# EAGLE schematic ex.05 (EAGLE 9.6.2)
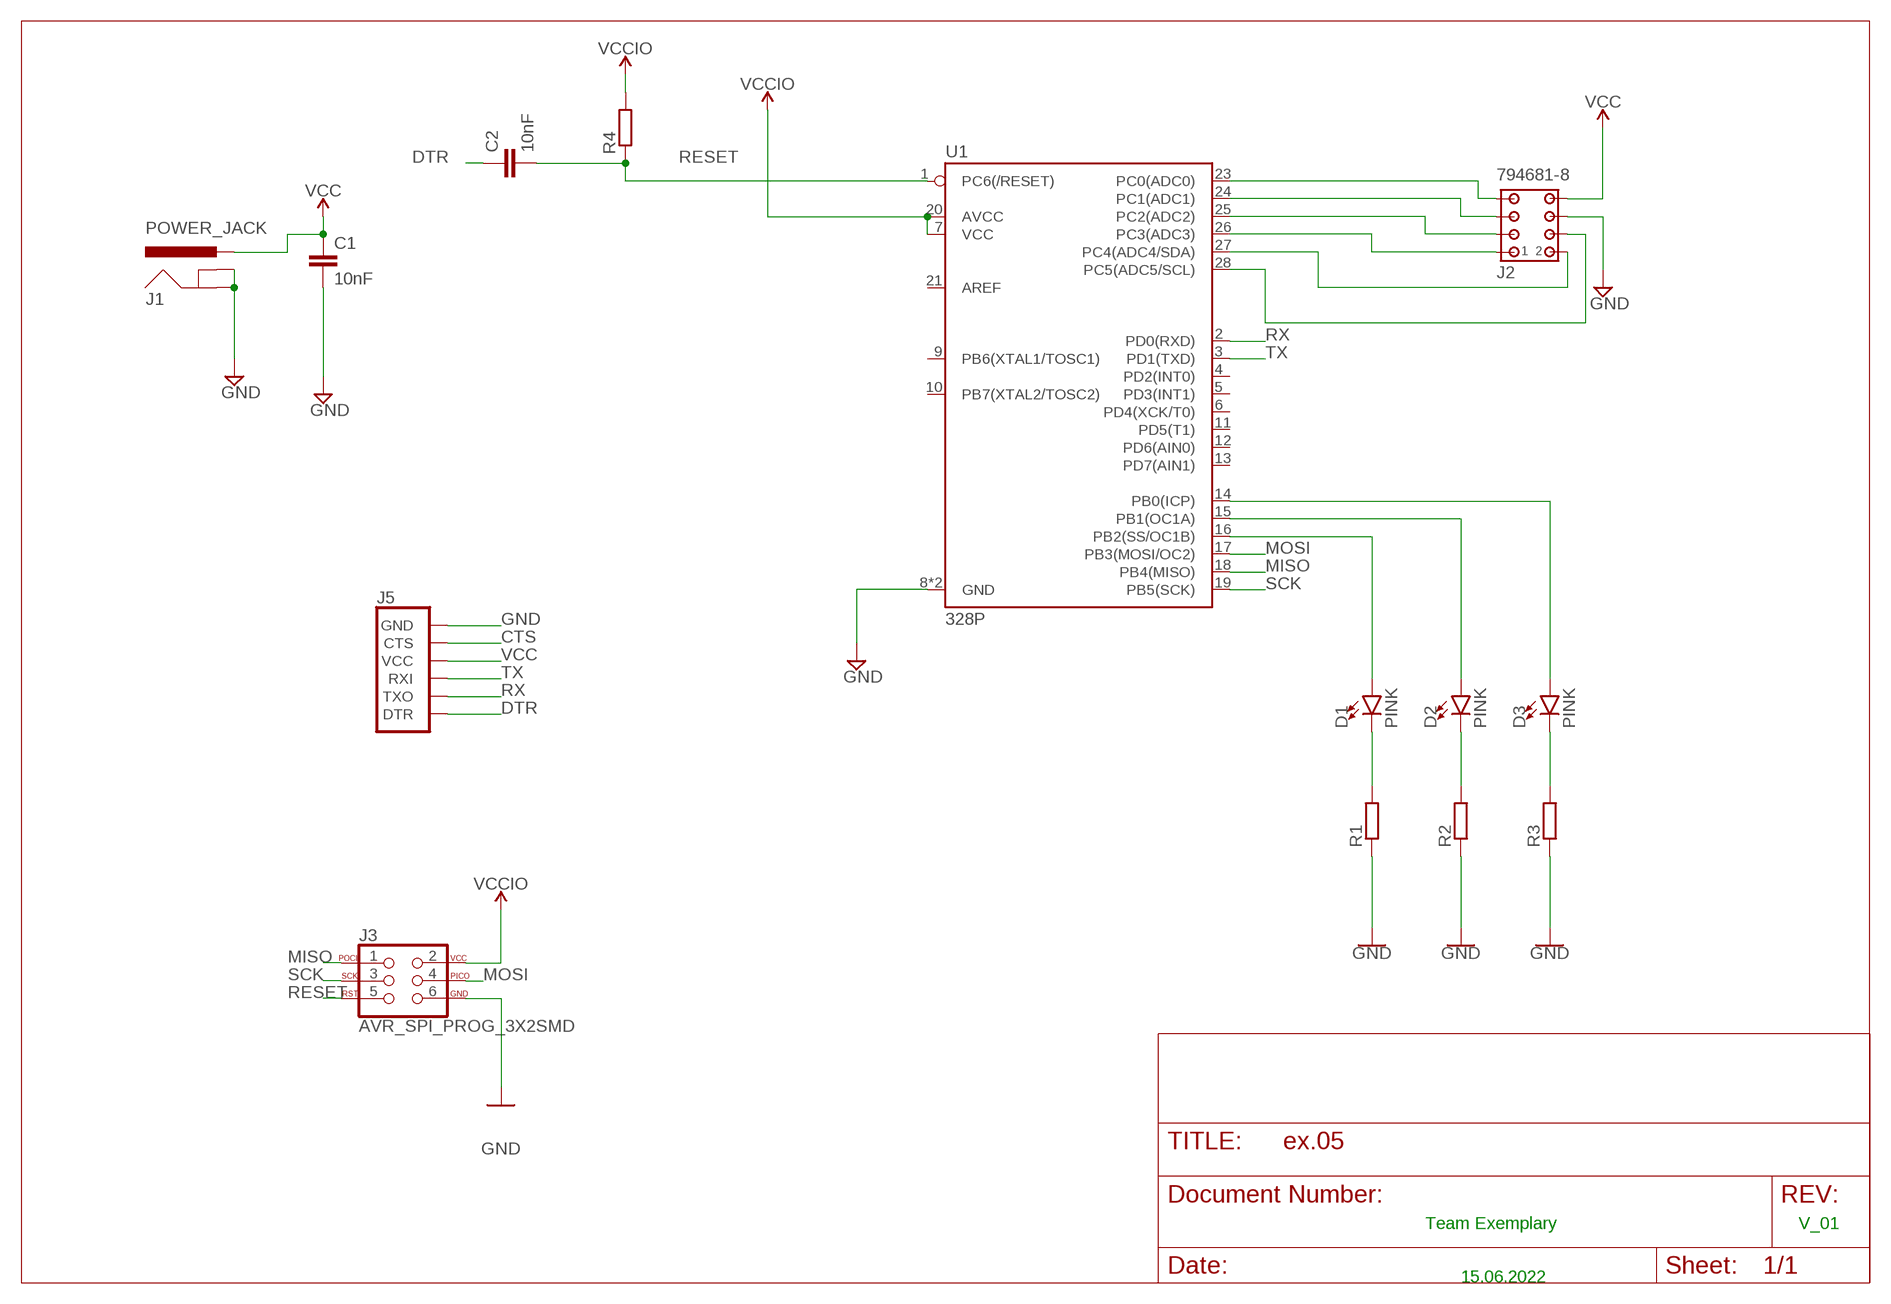
[diagram p0: schematic, sheet 1]

## Parts
C1  10nF  10NF-PTH-10MM-10000V-1-%  [CAP-PTH-10MM]
C2  10nF  10NF-PTH-10MM-10000V-1-%  [CAP-PTH-10MM]
D1  PINK  LED-PINK1206  [LED-1206]
D2  PINK  LED-PINK1206  [LED-1206]
D3  PINK  LED-PINK1206  [LED-1206]
J1  POWER_JACK  [POWER_JACK_PTH]
J2  794681-8  [794681-8]
J3  AVR_SPI_PROG_3X2SMD  [2X3_SMT_POSTS]
J5  6_PIN_SERIAL_TARGETLOCK  [1X06_LOCK]
R1  PMD  [PMD]
R2  PMD  [PMD]
R3  PMD  [PMD]
R4  PMD  [PMD]
U1  328P  ATMEGA328P_PDIP  [DIP28]

## Nets
CTS: J5.5(CTS)
DTR: C2.1 J5.1(DTR)
GND: C1.2 J1.GND J1.GNDBREAK J2.6 J3.6 J5.6(GND) R1.2 R2.2 R3.2 U1.8(GND) U1.22(GND)
MISO: J3.1 U1.18(PB4(MISO))
MOSI: J3.4 U1.17(PB3(MOSI/OC2))
N$2: D3.A U1.14(PB0(ICP))
N$3: D2.A U1.15(PB1(OC1A))
N$4: D1.A U1.16(PB2(SS/OC1B))
N$5: D1.C R1.1
N$6: D2.C R2.1
N$7: D3.C R3.1
N$8: J2.7 U1.23(PC0(ADC0))
N$9: J2.5 U1.24(PC1(ADC1))
N$10: J2.3 U1.25(PC2(ADC2))
N$11: J2.1 U1.26(PC3(ADC3))
N$12: J2.4 U1.28(PC5(ADC5/SCL))
N$13: J2.2 U1.27(PC4(ADC4/SDA))
RESET: C2.2 J3.5 R4.2 U1.1(PC6(/RESET))
RX: J5.3(TXO) U1.2(PD0(RXD))
SCK: J3.3 U1.19(PB5(SCK))
TX: J5.2(RXI) U1.3(PD1(TXD))
VCC: C1.1 J1.PWR J2.8 J5.4(VCC)
VCCIO: J3.2 R4.1 U1.7(VCC) U1.20(AVCC)
Unconnected: U1.4(PD2(INT0)) U1.5(PD3(INT1)) U1.6(PD4(XCK/T0)) U1.9(PB6(XTAL1/TOSC1)) U1.10(PB7(XTAL2/TOSC2)) U1.11(PD5(T1)) U1.12(PD6(AIN0)) U1.13(PD7(AIN1)) U1.21(AREF)

## Notes on the sheet
- Team Exemplary | V_01
- 15.06.2022

## Library data of the parts
C1 C2 = SparkFun-Capacitors:10NF: 0.01uF/10nF/10,000pF ceramic capacitors A capacitor is a passive two-terminal electrical component used to store electrical energy temporarily in an electric field. CAP-09321; PROD_ID: CAP-09321
D1-D3 = SparkFun-LED:LED-PINK: Pink SMD LED Used in manufacturing of various products at SparkFun Packages: 0603 - SMD 0603 package [Product Link] <http://cdn.sparkfun.com/datasheets/Components/General/S1206PKSBJC.pdf> SparkFun Products: LilyPad LED Pink <https://www.sparkfun.com/products/10962>; PROD_ID: DIO-10415
J1 = SparkFun-Connectors:POWER_JACK: Power Jack Connector This is the standard 5.5mm barrel jack for power. The PTH is the most common, proven, reliable, footprint. The Slot footprint only works if the mill layer is transmitted to the PCB fab house so be warned. Here are the connectors we sell at SparkFun: DC Barrel Power Jack/Connector <https://www.sparkfun.com/products/119> (PRT-00119) DC Barrel Power Jack/Connector (SMD) <https://www.sparkfun.com/products/12748> (PRT-12748) DC Barrel Jack Adapter - Breadboard Compatible <https://www.sparkfun.com/products/10811> (PRT-10811) It is used on this SparkFun product (and many, many others): SparkFun RedBoard - Programmed with Arduino <https://www.sparkfun.com/products/12757> (DEV-12757) Also, if you need a mating power supply or connector, please check these out: Wall Adapter Power Supply - 9VDC 650mA <https://www.sparkfun.com/products/298> (TOL-00298) DC Barrel Jack Adapter - Male <https://www.sparkfun.com/products/10287> (PRT-10287); PROD_ID: CONN-08197
J2 = con-amp:794681-8: Micro MATE-N-LOK Connectors grid 1.5mm Dual Row Through Hole Vertical Metal Through Hole Holddowns Source: ENG_CD_794681_E.pdf
J3 = SparkFun-Connectors:AVR_SPI_PROG_3X2: AVR ISP 6 Pin This is the reduced ISP connector for AVR programming. Common on Arduino. This footprint will take up less PCB space and can be used with a 10-pin to 6-pin adapter such as SKU: BOB-08508 **Special note about "TEST_POINT" package. The stop mask is on the top side, so if you want your programming test points to be on the bottom of your board, make sure to place this package on the bottom side of the board. This also ensure that the orientation to program from the bottom side will be correct. SparkFun Products: SparkFun ISP Pogo Adapter <https://www.sparkfun.com/products/11591> - NS Tiny AVR Programmer <https://www.sparkfun.com/products/11801> -PTH
J5 = SparkFun-Connectors:6_PIN_SERIAL_TARGET: 6-pin header connection for use with the "FTDI BASIC" pinout - TARGET SIDE. Also known as "Arduino Serial Program Header". It is used to mate with our FTDI Basic serial programmers using the Arduino IDE. Note, this device has "TARGET" in the name. It is intended to be used on a design that contains a target micro-controller that you wish to program. The "sister" device, named "CABLE" is inteneded to be used on a design that usually lives on the end of your USB cable and prvides the converter chip (FTDI232 or FTDI231x) to commnicate serial RX/TX. You can populate with some of these: Break Away Headers - Straight <https://www.sparkfun.com/products/116> (PRT-00116) For reference (or to suit your programming needs) check out these designs: SparkFun FTDI Basic Breakout - 5V <https://www.sparkfun.com/products/9716> (DEV-09716) SparkFun FTDI Basic Breakout - 3.3V <https://www.sparkfun.com/products/9873> (DEV-09873) SparkFun FTDI SmartBasic <https://www.sparkfun.com/products/12935> (DEV-12935) SparkFun Beefy 3 - FTDI Basic Breakout <https://www.sparkfun.com/products/13746> (DEV-13746); PROD_ID: CONN-08437
R1-R4 = resistor-shunt:PMD: SMD SHUNT RESISTOR; OC_FARNELL: unknown; OC_NEWARK: unknown
U1 = SparkFun-IC-Microcontroller:ATMEGA328P_PDIP: Atmel 328P Through hole ATMEGA328P uC used in the Arduino 32kb flash, 1k EEPROM, 2k SRAM Datasheet <http://www.sparkfun.com/datasheets/Components/SMD/ATMega328.pdf> SparkFun Products Storefront component: AVR 28 Pin 20MHz 32K 6A/D - ATMega328P <https://www.sparkfun.com/products/9061> (COM-09061) SparkFun Simon Says - Through-Hole Soldering Kit <https://www.sparkfun.com/products/10547> (KIT-10547) SparkFun Learn to Solder - Simon Says <https://www.sparkfun.com/products/13708> (KIT-13708) SparkFun BigTime Watch Kit <https://www.sparkfun.com/products/11734> (KIT-11734) SparkFun ClockIt <https://www.sparkfun.com/products/10930> (KIT-10930) SparkFun Serial Enabled LCD Kit <https://www.sparkfun.com/products/10097> (LCD-10097) SparkFun Simon Tilts - Through Hole Soldering Kit <https://www.sparkfun.com/products/12634> (KIT-12634) SparkFun Frequency Counter Kit <https://www.sparkfun.com/products/10140> (KIT-10140) FabFM Radio Kit <https://www.sparkfun.com/products/11043> (KIT-11043) SparkFun Binary Blaster Kit <https://www.sparkfun.com/products/12037> (KIT-12037) SparkFun Metro-Gnome <https://www.sparkfun.com/products/9236> (KIT-09236) ATmega328 with Arduino Optiboot (Uno) <https://www.sparkfun.com/products/10524> (DEV-10524); PROD_ID: IC-09136